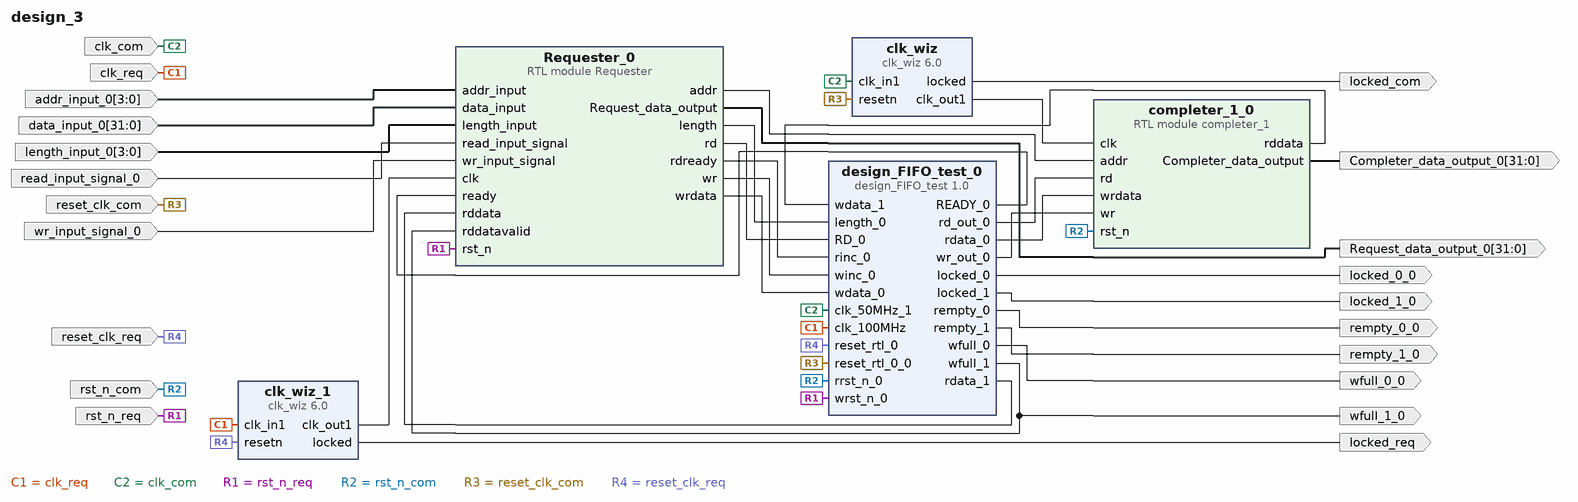
[diagram p0: block diagram of the top level]
# Vivado block design design_3, xc7a12ticsg325-1L, Vivado 2025.2
create_bd_design design_3

create_bd_port -dir O -from 31 -to 0 Request_data_output_0
create_bd_port -dir I wr_input_signal_0
create_bd_port -dir I read_input_signal_0
create_bd_port -dir I -from 3 -to 0 addr_input_0
create_bd_port -dir I -from 3 -to 0 length_input_0
create_bd_port -dir I -from 31 -to 0 data_input_0
create_bd_port -dir O -from 31 -to 0 Completer_data_output_0
create_bd_port -dir I -type clk clk_req
create_bd_port -dir I -type clk clk_com
create_bd_port -dir I -type rst rst_n_com
create_bd_port -dir I -type rst rst_n_req
create_bd_port -dir O locked_com
create_bd_port -dir O locked_req
create_bd_port -dir O locked_0_0
create_bd_port -dir O locked_1_0
create_bd_port -dir O rempty_0_0
create_bd_port -dir O rempty_1_0
create_bd_port -dir O wfull_0_0
create_bd_port -dir O wfull_1_0
create_bd_port -dir I -type rst reset_clk_req
create_bd_port -dir I -type rst reset_clk_com

create_bd_cell -type module -reference completer_1 completer_1_0
create_bd_cell -type module -reference Requester Requester_0
create_bd_cell -type ip -vlnv xilinx.com:ip:clk_wiz:6.0 clk_wiz
set_property -dict [list \
  CONFIG.CLKOUT1_REQUESTED_OUT_FREQ 50 \
  CONFIG.RESET_PORT resetn \
  CONFIG.RESET_TYPE ACTIVE_LOW \
] [get_bd_cells clk_wiz]
create_bd_cell -type ip -vlnv xilinx.com:ip:clk_wiz:6.0 clk_wiz_1
set_property -dict [list \
  CONFIG.CLKOUT1_REQUESTED_OUT_FREQ 100.0 \
  CONFIG.RESET_PORT resetn \
  CONFIG.RESET_TYPE ACTIVE_LOW \
] [get_bd_cells clk_wiz_1]
create_bd_cell -type ip -vlnv xilinx.com:user:design_FIFO_test:1.0 design_FIFO_test_0

# ---- connections ----

connect_bd_net [get_bd_pins Requester_0/Request_data_output] [get_bd_ports Request_data_output_0]
connect_bd_net [get_bd_pins Requester_0/addr] [get_bd_pins completer_1_0/addr]
connect_bd_net [get_bd_pins Requester_0/length] [get_bd_pins design_FIFO_test_0/length_0]
connect_bd_net [get_bd_pins Requester_0/rd] [get_bd_pins design_FIFO_test_0/RD_0]
connect_bd_net [get_bd_pins Requester_0/rdready] [get_bd_pins design_FIFO_test_0/rinc_0]
connect_bd_net [get_bd_pins Requester_0/wr] [get_bd_pins design_FIFO_test_0/winc_0]
connect_bd_net [get_bd_pins Requester_0/wrdata] [get_bd_pins design_FIFO_test_0/wdata_0]
connect_bd_net -net addr_input_0_1 [get_bd_ports addr_input_0] [get_bd_pins Requester_0/addr_input]
connect_bd_net -net clk_in1_0_1 [get_bd_ports clk_req] [get_bd_pins clk_wiz_1/clk_in1] [get_bd_pins design_FIFO_test_0/clk_100MHz]
connect_bd_net -net clk_in1_1_1 [get_bd_ports clk_com] [get_bd_pins clk_wiz/clk_in1] [get_bd_pins design_FIFO_test_0/clk_50MHz_1]
connect_bd_net [get_bd_pins clk_wiz_1/clk_out1] [get_bd_pins Requester_0/clk]
connect_bd_net [get_bd_pins clk_wiz_1/locked] [get_bd_ports locked_req]
connect_bd_net [get_bd_pins clk_wiz/clk_out1] [get_bd_pins completer_1_0/clk]
connect_bd_net [get_bd_pins clk_wiz/locked] [get_bd_ports locked_com]
connect_bd_net [get_bd_pins completer_1_0/Completer_data_output] [get_bd_ports Completer_data_output_0]
connect_bd_net [get_bd_pins completer_1_0/rddata] [get_bd_pins design_FIFO_test_0/wdata_1]
connect_bd_net -net data_input_0_1 [get_bd_ports data_input_0] [get_bd_pins Requester_0/data_input]
connect_bd_net [get_bd_pins design_FIFO_test_0/READY_0] [get_bd_pins Requester_0/ready]
connect_bd_net [get_bd_pins design_FIFO_test_0/locked_0] [get_bd_ports locked_0_0]
connect_bd_net [get_bd_pins design_FIFO_test_0/locked_1] [get_bd_ports locked_1_0]
connect_bd_net [get_bd_pins design_FIFO_test_0/rd_out_0] [get_bd_pins completer_1_0/rd]
connect_bd_net [get_bd_pins design_FIFO_test_0/rdata_0] [get_bd_pins completer_1_0/wrdata]
connect_bd_net [get_bd_pins design_FIFO_test_0/rdata_1] [get_bd_pins Requester_0/rddata]
connect_bd_net [get_bd_pins design_FIFO_test_0/rempty_0] [get_bd_ports rempty_0_0]
connect_bd_net [get_bd_pins design_FIFO_test_0/rempty_1] [get_bd_ports rempty_1_0]
connect_bd_net [get_bd_pins design_FIFO_test_0/wfull_0] [get_bd_ports wfull_0_0]
connect_bd_net [get_bd_pins design_FIFO_test_0/wfull_1] [get_bd_ports wfull_1_0] [get_bd_pins Requester_0/rddatavalid]
connect_bd_net [get_bd_pins design_FIFO_test_0/wr_out_0] [get_bd_pins completer_1_0/wr]
connect_bd_net -net length_input_0_1 [get_bd_ports length_input_0] [get_bd_pins Requester_0/length_input]
connect_bd_net -net read_input_signal_0_1 [get_bd_ports read_input_signal_0] [get_bd_pins Requester_0/read_input_signal]
connect_bd_net -net reset_bridge1_0_sys_rst_n [get_bd_ports rst_n_req] [get_bd_pins Requester_0/rst_n] [get_bd_pins design_FIFO_test_0/wrst_n_0]
connect_bd_net -net reset_bridge1_1_sys_rst_n [get_bd_ports rst_n_com] [get_bd_pins completer_1_0/rst_n] [get_bd_pins design_FIFO_test_0/rrst_n_0]
connect_bd_net -net reset_com [get_bd_ports reset_clk_com] [get_bd_pins clk_wiz/resetn] [get_bd_pins design_FIFO_test_0/reset_rtl_0_0]
connect_bd_net -net reset_rtl_0_0_1 [get_bd_ports reset_clk_req] [get_bd_pins clk_wiz_1/resetn] [get_bd_pins design_FIFO_test_0/reset_rtl_0]
connect_bd_net -net wr_input_signal_0_1 [get_bd_ports wr_input_signal_0] [get_bd_pins Requester_0/wr_input_signal]

validate_bd_design
save_bd_design
